# Altium schematic sheet Panier.SchDoc
size A2
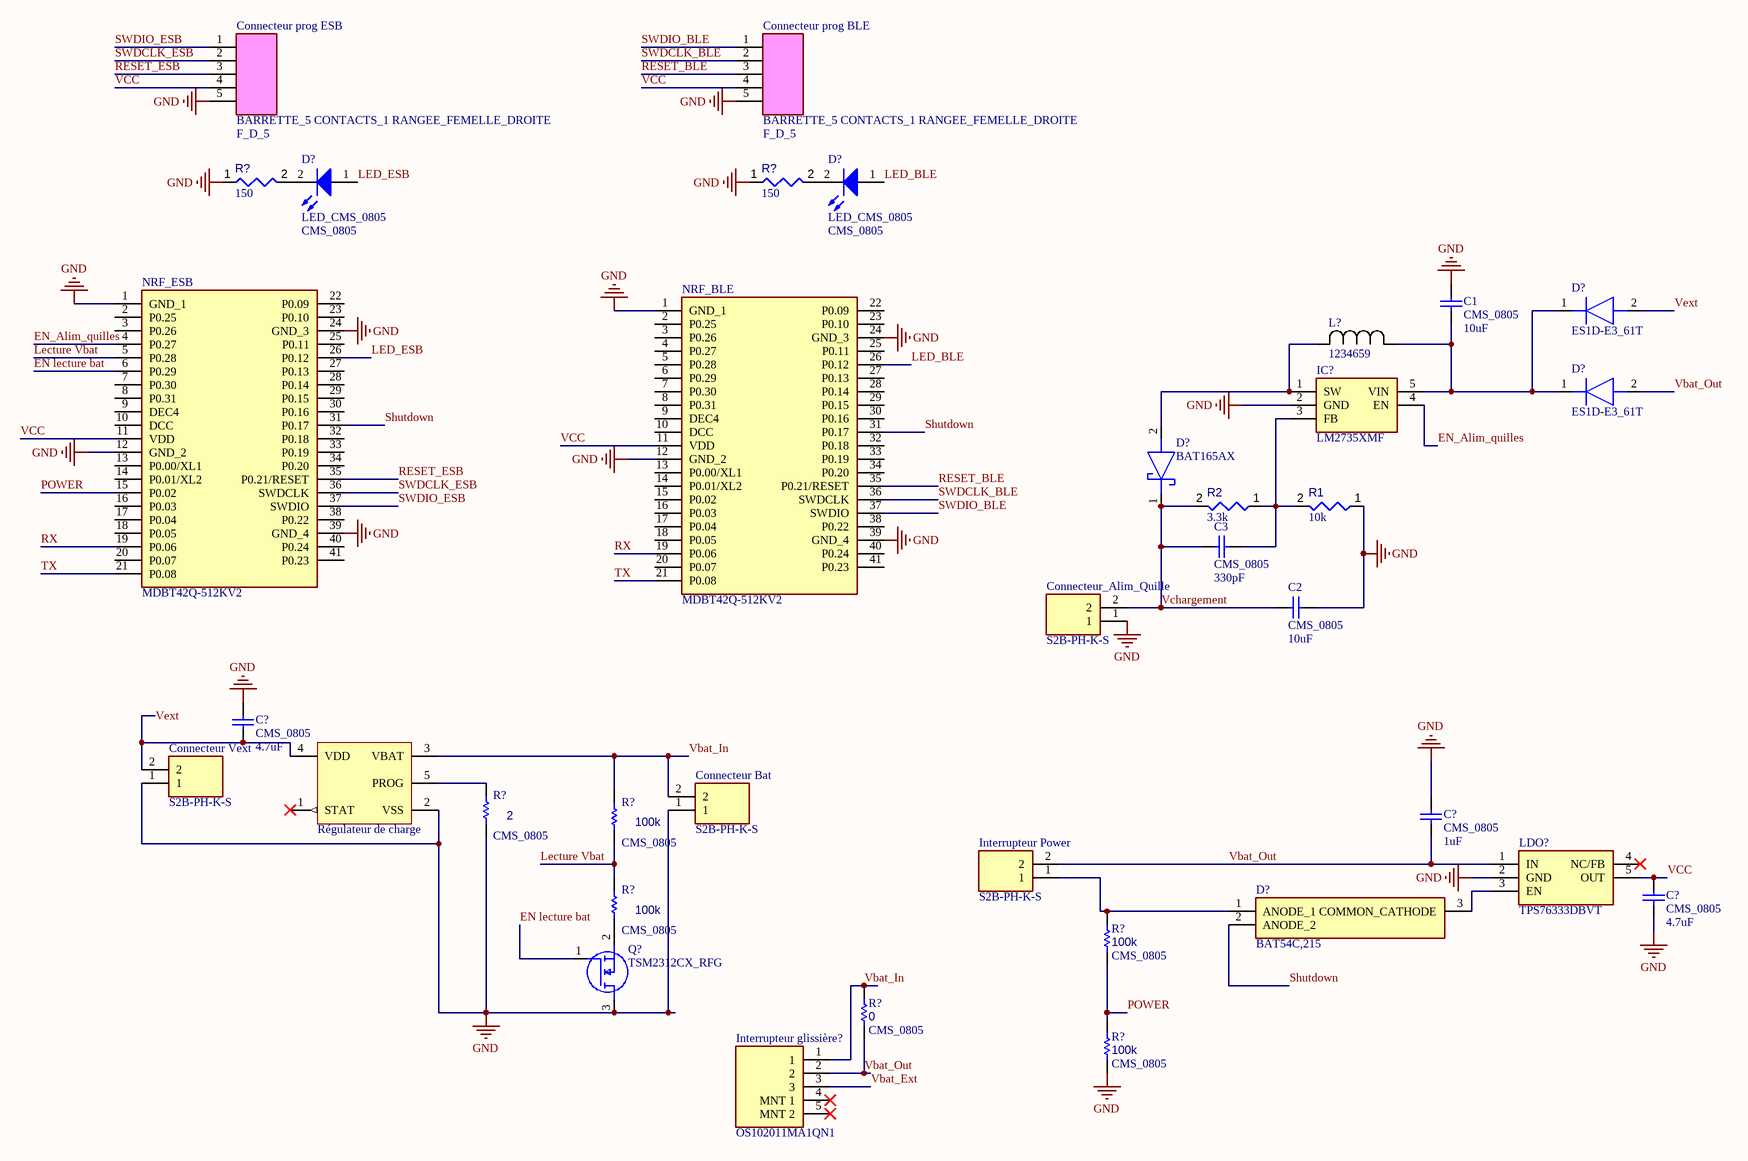
[diagram p0: Panier.SchDoc]

## Parts
(Parts that share a designator on the sheet are numbered #1, #2 ... from top to bottom, then left to right.)
C1  value 10uF  Type: CMS_0805  [CONDENSATEUR_CMS_0805]  (hidden comment: CONDENSATEUR_CMS_CER_0805)
C2  value 10uF  Type: CMS_0805  [CONDENSATEUR_CMS_0805]  (hidden comment: CONDENSATEUR_CMS_CER_0805)
C3  value 330pF  Type: CMS_0805  [CONDENSATEUR_CMS_0805]  (hidden comment: CONDENSATEUR_CMS_CER_0805)
C?#1  value 4.7uF  Type: CMS_0805  [CONDENSATEUR_CMS_0805]  (hidden comment: CONDENSATEUR_CMS_CER_0805)
C?#2  value 1uF  Type: CMS_0805  [CONDENSATEUR_CMS_0805]  (hidden comment: CONDENSATEUR_CMS_CER_0805)
C?#3  value 4.7uF  Type: CMS_0805  [CONDENSATEUR_CMS_0805]  (hidden comment: CONDENSATEUR_CMS_CER_0805)
Connecteur_Alim_Quille  S2B-PH-K-S  [S2BPHKS]
Connecteur_Bat  S2B-PH-K-S  [S2BPHKS]
Connecteur_prog_BLE  BARRETTE_5 CONTACTS_1 RANGEE_FEMELLE_DROITE  Type: F_D_5  [BARRETTE_5_F_D]
Connecteur_prog_ESB  BARRETTE_5 CONTACTS_1 RANGEE_FEMELLE_DROITE  Type: F_D_5  [BARRETTE_5_F_D]
Connecteur_Vext  S2B-PH-K-S  [S2BPHKS]
D?#1  LED_CMS_0805  Type: CMS_0805  [LED_CMS_0805]
D?#2  LED_CMS_0805  Type: CMS_0805  [LED_CMS_0805]
D?#3  ES1D-E3_61T  [DIOM5127X229N]
D?#4  ES1D-E3_61T  [DIOM5127X229N]
D?#5  BAT165AX  [BAT165AX]
D?#6  BAT54C,215  [BAT54C215]
IC?  LM2735XMF  [SOT95P285X110-5N]
Interrupteur_glissière?  Part Number: OS102011MA1QN1  [C&K_OS102011MA1QN1_0]  (hidden comment: Switch_C&K_OS102011MA1QN1_eec)
Interrupteur_Power  S2B-PH-K-S  [S2BPHKS]
L?  1234659  [IND_123_4659_RSP]
LDO?  TPS76333DBVT  [SOT95P280X145-5N]
NRF_BLE  MDBT42Q-512KV2  [MDBT42Q512KV2]
NRF_ESB  MDBT42Q-512KV2  [MDBT42Q512KV2]
Q?  TSM2312CX_RFG  [SOT95P280X130-3N]
R1  value 10k  [RESC2013X50X35ML15T15]  (hidden comment: Resistor 10k +/-1% 0805 125 mW)
R2  value 3.3k  [RESC2013X50X35ML15T15]  (hidden comment: Resistor 10k +/-1% 0805 125 mW)
R?#1  value 150  [RESC0805(2012)_L]  (hidden comment: Resistor 1K +/-5% 0805 125 mW)
R?#2  value 150  [RESC0805(2012)_L]  (hidden comment: Resistor 1K +/-5% 0805 125 mW)
R?#3  value 2  Type: CMS_0805  [RESISTANCE_CMS_0805]  (hidden comment: RESISTANCE_CMS_0805)
R?#4  value 100k  Type: CMS_0805  [RESISTANCE_CMS_0805]  (hidden comment: RESISTANCE_CMS_0805)
R?#5  value 100k  Type: CMS_0805  [RESISTANCE_CMS_0805]  (hidden comment: RESISTANCE_CMS_0805)
R?#6  value 100k  Type: CMS_0805  [RESISTANCE_CMS_0805]  (hidden comment: RESISTANCE_CMS_0805)
R?#7  value 0  Type: CMS_0805  [RESISTANCE_CMS_0805]  (hidden comment: RESISTANCE_CMS_0805)
R?#8  value 100k  Type: CMS_0805  [RESISTANCE_CMS_0805]  (hidden comment: RESISTANCE_CMS_0805)
Régulateur_de_charge  MCP73831T-2DCI/OT  [SOT-23-OT5_N]  (value not drawn)

## Nets
GND: C1.2 C2.2 C?#1.2 C?#2.2 C?#3.1 Connecteur_Alim_Quille.1 Connecteur_Bat.1 Connecteur_prog_BLE.5 Connecteur_prog_ESB.5 Connecteur_Vext.1 IC?.2(GND) LDO?.2(GND) NRF_BLE.1(GND_1) NRF_BLE.12(GND_2) NRF_BLE.24(GND_3) NRF_BLE.39(GND_4) NRF_ESB.1(GND_1) NRF_ESB.12(GND_2) NRF_ESB.24(GND_3) NRF_ESB.39(GND_4) Q?.3(D) R1.1 R?#1.1 R?#2.1 R?#3.1 R?#8.1 Régulateur_de_charge.2(VSS)
EN lecture bat: NRF_ESB.6(P0.29) Q?.1(G)
EN_Alim_quilles: IC?.4(EN) NRF_ESB.4(P0.27)
Lecture Vbat: NRF_ESB.5(P0.28) R?#4.1 R?#5.2
LED_BLE: D?#2.1 NRF_BLE.26(P0.12)
LED_ESB: D?#1.1 NRF_ESB.26(P0.12)
POWER: NRF_ESB.15(P0.02) R?#6.1 R?#8.2
RESET_BLE: Connecteur_prog_BLE.3 NRF_BLE.35(P0.21/RESET)
RESET_ESB: Connecteur_prog_ESB.3 NRF_ESB.35(P0.21/RESET)
RX: NRF_BLE.19(P0.06) NRF_ESB.19(P0.06)
Shutdown: D?#6.2(ANODE_2) NRF_BLE.31(P0.17) NRF_ESB.31(P0.17)
SWDCLK_BLE: Connecteur_prog_BLE.2 NRF_BLE.36(SWDCLK)
SWDCLK_ESB: Connecteur_prog_ESB.2 NRF_ESB.36(SWDCLK)
SWDIO_BLE: Connecteur_prog_BLE.1 NRF_BLE.37(SWDIO)
SWDIO_ESB: Connecteur_prog_ESB.1 NRF_ESB.37(SWDIO)
TX: NRF_BLE.21(P0.08) NRF_ESB.21(P0.08)
Vbat_Ext: Interrupteur_glissière?.3
Vbat_In: Connecteur_Bat.2 Interrupteur_glissière?.1 R?#4.2 R?#7.2 Régulateur_de_charge.3(VBAT)
Vbat_Out: C?#2.1 D?#4.2(A) Interrupteur_glissière?.2 Interrupteur_Power.2 LDO?.1(IN) R?#7.1
VCC: C?#3.2 Connecteur_prog_BLE.4 Connecteur_prog_ESB.4 LDO?.5(OUT) NRF_BLE.11(VDD) NRF_ESB.11(VDD)
Vchargement: C2.1 C3.1 Connecteur_Alim_Quille.2 D?#5.1(K) R2.2
Vext: C?#1.1 Connecteur_Vext.2 D?#3.2(A) Régulateur_de_charge.4(VDD)
NetC1_1: C1.1 D?#3.1(K) D?#4.1(K) IC?.5(VIN) L?.1
NetC3_2: C3.2 IC?.3(FB) R1.2 R2.1
NetD?#1_2: D?#1.2 R?#1.2
NetD?#2_2: D?#2.2 R?#2.2
NetD?#5_2: D?#5.2(A) IC?.1(SW) L?.2
NetD?#6_1: D?#6.1(ANODE_1) Interrupteur_Power.1 R?#6.2
NetD?#6_3: D?#6.3(COMMON_CATHODE) LDO?.3(EN)
NetQ?_2: Q?.2(S) R?#5.1
NetR?#3_2: R?#3.2 Régulateur_de_charge.5(PROG)

Not connected (* = marked no-connect by the designer): Interrupteur_glissière? 4(MNT_1)* 5(MNT_2)*; LDO? 4(NC/FB)*; NRF_BLE 2(P0.25) 3(P0.26) 4(P0.27) 5(P0.28) 6(P0.29) 7(P0.30) 8(P0.31) 9(DEC4) 10(DCC) 13(P0.00/XL1) 14(P0.01/XL2) 15(P0.02) 16(P0.03) 17(P0.04) 18(P0.05) 20(P0.07) 22(P0.09) 23(P0.10) 25(P0.11) 27(P0.13) 28(P0.14) 29(P0.15) 30(P0.16) 32(P0.18) 33(P0.19) 34(P0.20) 38(P0.22) 40(P0.24) 41(P0.23); NRF_ESB 2(P0.25) 3(P0.26) 7(P0.30) 8(P0.31) 9(DEC4) 10(DCC) 13(P0.00/XL1) 14(P0.01/XL2) 16(P0.03) 17(P0.04) 18(P0.05) 20(P0.07) 22(P0.09) 23(P0.10) 25(P0.11) 27(P0.13) 28(P0.14) 29(P0.15) 30(P0.16) 32(P0.18) 33(P0.19) 34(P0.20) 38(P0.22) 40(P0.24) 41(P0.23); Régulateur_de_charge 1(STAT)*

## Library data of the parts
C1-C3 C?#1-C?#3 = CMP-038-0003-1: CONDENSATEUR CMS CERAMIQUE 0805; Source: composants passifs.SchLib; Design Item ID: CONDENSATEUR_CMS_CER_0805
Connecteur_Alim_Quille Connecteur_Bat Connecteur_Vext Interrupteur_Power = S2B-PH-K-S: Connector; Manufacturer_Name: JST (JAPAN SOLDERLESS TERMINALS); Datasheet Link: https://media.digikey.com/pdf/Data%20Sheets/JST%20PDFs/PH%20Series.pdf; Height: 4.8mm; Manufacturer_Part_Number: S2B-PH-K-S
Connecteur_prog_BLE Connecteur_prog_ESB = CMP-039-0118-1: BARRETTE 5 CONTACTS 1 RANGEE FEMELLE DROITE; Design Item ID: BARRETTE_5 CONTACTS_1 RANGEE_FEMELLE_DROITE; Source: connecteurs.SchLib
D?#1 D?#2 = CMP-024-0003-1: LED CMS 0805; Source: affichage.SchLib; Design Item ID: LED_CMS_0805
D?#3 D?#4 = ES1D-E3_61T: Diode; Manufacturer_Name: Vishay; Manufacturer_Part_Number: ES1D-E3/61T; Datasheet Link: https://componentsearchengine.com/Datasheets/2/ES1D-E3_61T.pdf; Height: 2.29mm; Mouser Part Number: 625-ES1D-E3; Mouser Price/Stock: https://www.mouser.co.uk/ProductDetail/Vishay-General-Semiconductor/ES1D-E3-61T?qs=rfh7uIuiIO0XwaKoN5aNdQ%3D%3D; Arrow Part Number: ES1D-E3/61T; Arrow Price/Stock: https://www.arrow.com/en/products/es1d-e361t/vishay
D?#5 = BAT165AX: Schottky Diode; Manufacturer_Name: Nexperia; Datasheet Link: https://assets.nexperia.com/documents/data-sheet/BAT165A.pdf; Height: 1.1mm; Manufacturer_Part_Number: BAT165AX; Mouser Part Number: 771-BAT165AX; Mouser Price/Stock: https://www.mouser.co.uk/ProductDetail/Nexperia/BAT165AX?qs=1fQ7IOp4WriMQ9TlJoQ5jw%3D%3D; Arrow Part Number: BAT165AX; Arrow Price/Stock: https://www.arrow.com/en/products/bat165ax/nexperia?region=nac
D?#6 = BAT54C,215: Schottky Diode; Manufacturer_Name: Nexperia; Datasheet Link: https://assets.nexperia.com/documents/data-sheet/BAT54_SER.pdf; Height: 1.1mm; Manufacturer_Part_Number: BAT54C,215; Mouser Part Number: 771-BAT54C-T/R; Mouser Price/Stock: https://www.mouser.co.uk/ProductDetail/Nexperia/BAT54C215?qs=me8TqzrmIYV5SKKt13YKQA%3D%3D; Arrow Part Number: BAT54C,215; Arrow Price/Stock: https://www.arrow.com/en/products/bat54c215/nexperia?region=nac
IC? = LM2735XMF: Integrated Circuit; Manufacturer_Name: Texas Instruments; Manufacturer_Part_Number: LM2735XMF
Interrupteur_glissière? = Switch_C&K_OS102011MA1QN1_eec: SWITCH SLIDE SPDT 100MA 12V; Manufacturer: C&K; helpURL: https://upverter.com/upn/revision/2b2ed0fd4d150582/; ComponentLink2Description: Datasheet; Temperature: -30°C to +70°C; Package: SW_SLIDE; Supplier 2: Mouser; Price: 0.290275964971; Supplier 1: Digi-Key; ComponentLink1URL: https://upverter.com/upn/revision/2b2ed0fd4d150582/; Supplier Part Number 2: OS102011MA1QN1; Supplier Part Number 1: CKN9559-ND; ComponentLink1Description: Upverter; ComponentLink2URL: https://www.ckswitches.com/media/1428/os.pdf; RoHS: TRUE; Mouser Part Number: OS102011MA1QN1; Temperature Range High: +70°C; Digikey Description: SWITCH SLIDE SPDT 100MA 12V; Digikey Part Number: CKN9559-ND; Lead Free: yes; Temperature Range Low: -30°C
L? = 1234659: No Description Available; Mfr_Name: RS Pro; Type: DEV; Copyright: Copyright (C) 2022 Ultra Librarian. All rights reserved.; Manufacturer_Part_Number: 1234659; RefDes: RefDes
LDO? = TPS76333DBVT: Integrated Circuit; Manufacturer_Name: Texas Instruments; Datasheet Link: https://datasheet.datasheetarchive.com/originals/distributors/Datasheets-36/DSA-717371.pdf; Height: 1.45mm; Manufacturer_Part_Number: TPS76333DBVT; Mouser Part Number: 595-TPS76333DBVT; Mouser Price/Stock: https://www.mouser.co.uk/ProductDetail/Texas-Instruments/TPS76333DBVT?qs=tJ5HNKWh3OU6kt%2FvF%2F5hDQ%3D%3D; Arrow Part Number: TPS76333DBVT; Arrow Price/Stock: https://www.arrow.com/en/products/tps76333dbvt/texas-instruments?region=nac
NRF_BLE NRF_ESB = MDBT42Q-512KV2: Integrated Circuit; Manufacturer_Name: Raytac; Datasheet Link: http://www.raytac.com/download/index.php?index_id=27; Height: 2.2mm; Manufacturer_Part_Number: MDBT42Q-512KV2
Q? = TSM2312CX_RFG: MOSFET (N-Channel); Manufacturer_Name: Taiwan Semiconductor; Manufacturer_Part_Number: TSM2312CX RFG; Datasheet Link: https://datasheet.datasheetarchive.com/originals/distributors/DKDS-20/389616.pdf; Height: 1.3mm; Mouser Part Number: 821-TSM2312CXRFG; Mouser Price/Stock: https://www.mouser.co.uk/ProductDetail/Taiwan-Semiconductor/TSM2312CX-RFG?qs=QEzMiVqgwc0lDLiJAqaF%252Bw%3D%3D; Arrow Part Number: TSM2312CX RFG; Arrow Price/Stock: https://www.arrow.com/en/products/tsm2312cxrfg/taiwan-semiconductor?region=asia
R1 R2 = CMP-009-00018-5: Chip Resistor, 10 KOhm, +/- 1%, 125 mW, -55 to 155 degC, 0805 (2012 Metric); Power: 125mW; Voltage Rating: 150V; Tolerance: 1%; Pins: 2; Min Operating Temperature: -55°C; Case/Package: 0805; Max Operating Temperature: 155°C; RoHS Compliant: True; Mounting Technology: SM
R?#1 R?#2 = CMP-009-00118-3: Chip Resistor, 1 kOhms, +/-5%, 125 mW, -55 to 155 degC, 0805; Tolerance: 5%; Power: 125mW; Case/Package: 0805; Pins: 2; Min Operating Temperature: -55°C; Max Operating Temperature: 155°C
R?#3-R?#8 = CMP-037-0001-1: RESISTANCE CMS 0805; Design Item ID: RESISTANCE_CMS_0805; Source: composants passifs.SchLib
Régulateur_de_charge = CMP-045-0000-1: Miniature Single-Cell, Fully Integrated Li-Ion, Li-Polymer Charge Management Controller, 4.2V, 5-Pin SOT-23, Industrial Temperature, Tape and Reel; Manufacturer: Microchip; PackageReference: SOT-23-OT5; Code_IPC: SOT23-5; Source: energie.SchLib; PartNumber: MCP73831T-2DCI/OT; PackageVersion: revBB, Aug-2009; Design Item ID: MCP73831T-2DCI/OT; Mounting Technology: Surface Mount; PackageDescription: 5-Lead Plastic Small Outline Transistor (OT) [SOT-23]; ComponentLink1URL: http://www.microchip.com/; ComponentLink1Description: Manufacturer URL; ComponentLink3Description: Package Specification; ComponentLink2Description: Datasheet; DatasheetVersion: revE, Sep-2008; ComponentLink2URL: http://ww1.microchip.com/downloads/en/DeviceDoc/21984e.pdf; ComponentLink3URL: http://www.microchip.com/stellent/groups/techpub_sg/documents/packagingspec/en012702.pdf